# Altium schematic sheet EFM32_power.SchDoc
size A4; DocumentNumber: 6; SheetNumber: 6; SheetTotal: 21; SheetName: Microcontroller Power Distribution
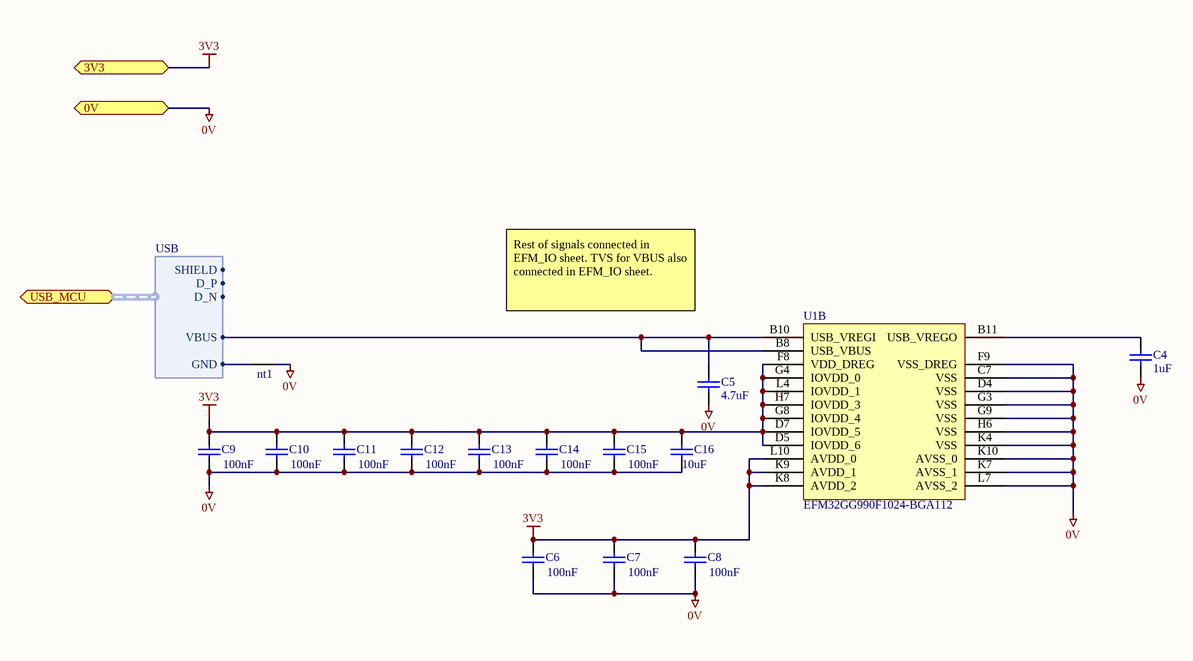
[diagram p0: EFM32_power.SchDoc]

## Parts
C4  value 1uF  [CAPC0603(1608)100_M]  (hidden comment: CAP 1uF 16V 0603(1608))
C5  value 4.7uF  [CAPC0603(1608)100_M]  (hidden comment: CAP 4.7uF 16V 0603(1608))
C6  value 100nF  [CAPC0603(1608)100_M]  (hidden comment: CAP 100nF 16V 0603(1608))
C7  value 100nF  [CAPC0603(1608)100_M]  (hidden comment: CAP 100nF 16V 0603(1608))
C8  value 100nF  [CAPC0603(1608)100_M]  (hidden comment: CAP 100nF 16V 0603(1608))
C9  value 100nF  [CAPC0603(1608)100_M]  (hidden comment: CAP 100nF 16V 0603(1608))
C10  value 100nF  [CAPC0603(1608)100_M]  (hidden comment: CAP 100nF 16V 0603(1608))
C11  value 100nF  [CAPC0603(1608)100_M]  (hidden comment: CAP 100nF 16V 0603(1608))
C12  value 100nF  [CAPC0603(1608)100_M]  (hidden comment: CAP 100nF 16V 0603(1608))
C13  value 100nF  [CAPC0603(1608)100_M]  (hidden comment: CAP 100nF 16V 0603(1608))
C14  value 100nF  [CAPC0603(1608)100_M]  (hidden comment: CAP 100nF 16V 0603(1608))
C15  value 100nF  [CAPC0603(1608)100_M]  (hidden comment: CAP 100nF 16V 0603(1608))
C16  value 10uF  [CAPC0603(1608)100_M]  (hidden comment: CAP 10uF 10V 0603(1608))
nt1  net tie  [net tie]  (value not drawn)  (net tie, no BOM)
U1  EFM32GG990F1024-BGA112  [ENMR-BGA112]  (part B of 2)

## Ports
0V, 3V3, USB_MCU (harness USB)

## Harnesses
USB: D_P, D_N, VBUS, GND, SHIELD

## Nets
0V: C4.1 C5.1 C6.1 C7.1 C8.1 C9.1 C10.1 C11.1 C12.1 C13.1 C14.1 C15.1 C16.1 nt1.1 U1.C7(VSS) U1.D4(VSS) U1.F9(VSS_DREG) U1.G3(VSS) U1.G9(VSS) U1.H6(VSS) U1.K4(VSS) U1.K7(AVSS_1) U1.K10(AVSS_0) U1.L7(AVSS_2) ; port 0V
3V3: C6.2 C7.2 C8.2 C9.2 C10.2 C11.2 C12.2 C13.2 C14.2 C15.2 C16.2 U1.D5(IOVDD_6) U1.D7(IOVDD_5) U1.F8(VDD_DREG) U1.G4(IOVDD_0) U1.G8(IOVDD_4) U1.H7(IOVDD_3) U1.K8(AVDD_2) U1.K9(AVDD_1) U1.L4(IOVDD_1) U1.L10(AVDD_0) ; port 3V3
NetC4_2: C4.2 U1.B11(USB_VREGO)
NetC5_2: C5.2 U1.B8(USB_VBUS) U1.B10(USB_VREGI) ; port USB_MCU.VBUS
Netnt1_0: nt1.0 ; port USB_MCU.GND

## Notes on the sheet
- Rest of signals connected in EFM_IO sheet. TVS for VBUS also connected in EFM_IO sheet.
- Board:
- Version:
- Sheetname:
- Subject:
- Group:
- Sheet
- of
- Shematic file:

## Library data of the parts
C4 = CMP-1035-02736-1: CAP 1uF 16V ±5% 0603 (1608 Metric) Thickness 1mm SMD; Case-Metric: 1608; Case-EIA: 0603; Tolerance: Â±5%; Technology: SMT; Max Thickness: 1 mm; Rated Voltage: 16 V
C5 = CMP-1035-02788-1: CAP 4.7uF 16V ±10% 0603 (1608 Metric) Thickness 1mm SMD; Case-Metric: 1608; Tolerance: Â±10%; Case-EIA: 0603; Technology: SMT; Rated Voltage: 16 V; Max Thickness: 1 mm
C6-C15 = CMP-1035-02583-1: CAP 100nF 16V ±5% 0603 (1608 Metric) Thickness 1mm SMD; Tolerance: Â±5%; Case-Metric: 1608; Case-EIA: 0603; Rated Voltage: 16 V; Max Thickness: 1 mm; Technology: SMT
C16 = CMP-1035-02799-1: CAP 10uF 10V ±10% 0603 (1608 Metric) Thickness 1mm SMD; Tolerance: Â±10%; Case-Metric: 1608; Case-EIA: 0603; Max Thickness: 1 mm; Technology: SMT; Rated Voltage: 10 V
nt1 = net tie: used to connect nets without transferring net name
U1 = CMP-0270-00024-1: EFM32 Giant Gecko, M3 ARM Cortex CPU, 1024 KB Flash, 128 KB RAM, 1.85 - 3.8 V Supply, 48 MHz Max Speed, -40 to 85 degC, 112-Pin BGA, RoHS Compliant; LESENSE: Y; RAM (KB): 128; Flash (KB): 1024; LCD: 8x34; OPAMPS: 3; GPIO: 87; Max Speed (MHz): 48; ARM Cortex CPU: M3; DatasheetVersion: Rev 1.00; PartNumber: EFM32GG990F1024-BGA112; ComponentLink3Description: Package Specification; Subcategory: EFM32 Giant Gecko; PackageReference: BGA112; ComponentLink3URL: http://cdn.energymicro.com/dl/devices/pdf/d0007_efm32g290_datasheet.pdf; ComponentLink2Description: Datasheet; USB: Y; PackageDescription: 112-Pin Ball Grid Array, Body 10 x 10 mm, Pitch 0.8 mm; PackageVersion: Rev. 97SPP01315A_X03_06Jun11; ComponentLink1Description: Manufacturer URL; Supply Voltage (V): 1.85 - 3.8; Mounting Technology: Surface Mount; ComponentLink1URL: http://www.energymicro.com/; Generic Part Number: EFM32GG990; ComponentLink2URL: http://cdn.energymicro.com/dl/devices/pdf/d0046_efm32gg990_datasheet.pdf; PartId: 1